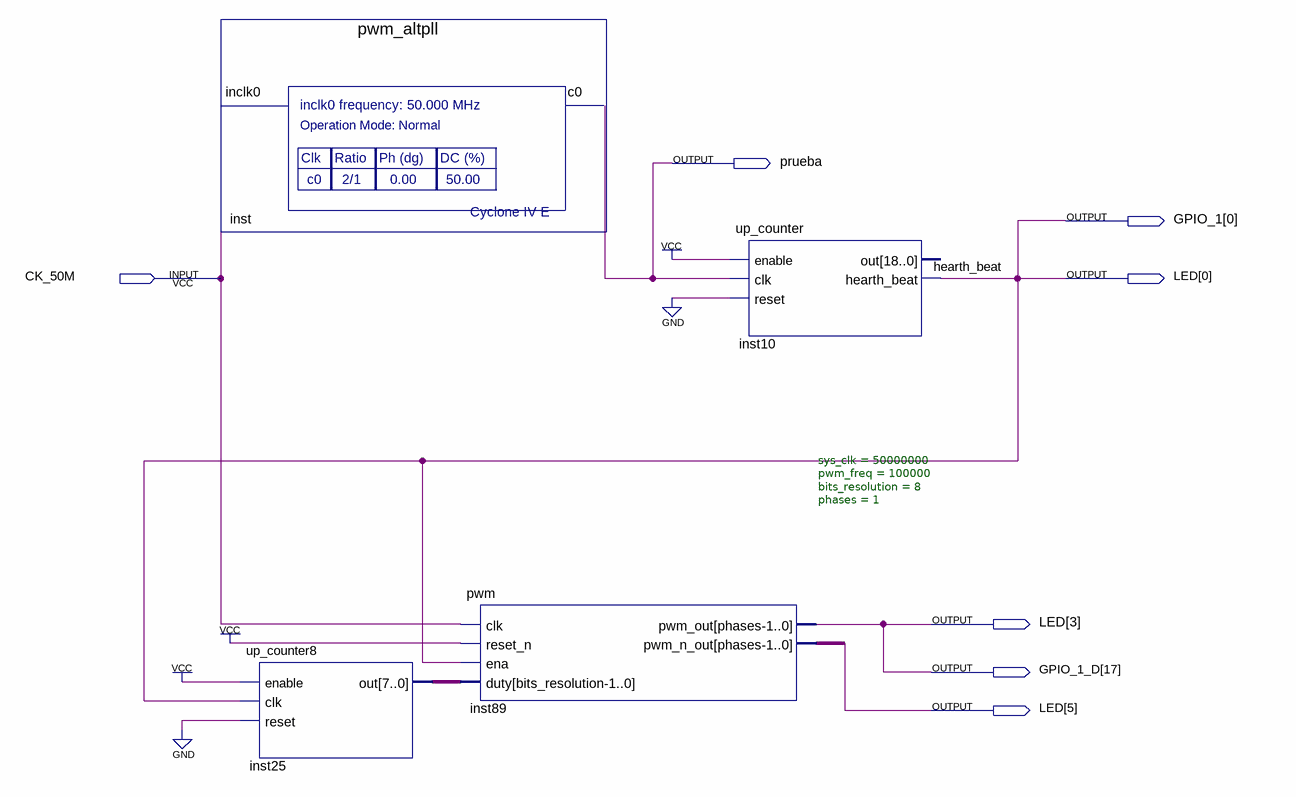
[diagram p0: schematic sheet]
// Quartus schematic Block2.bdf as structural Verilog: 4 symbols, 7 pins
module Block2 (
  input  CK_50M,
  output prueba,
  output [0:0] GPIO_1,
  output [5:0] LED,
  output [17:17] GPIO_1_D
);

  wire inst89_pwm_n_out;
  wire [7:0] inst25_out;

  pwm_altpll inst (.inclk0(CK_50M), .c0(prueba));
  up_counter8 inst25 (.enable(1'b1), .clk(GPIO_1[0]), .reset(1'b0), .out(inst25_out));
  pwm #(.sys_clk(50000000), .pwm_freq(100000), .bits_resolution(8), .phases(1)) inst89 (
    .clk(CK_50M), .reset_n(1'b1), .ena(GPIO_1[0]), .duty(inst25_out), .pwm_out(GPIO_1_D[17]),
    .pwm_n_out(inst89_pwm_n_out));
  up_counter inst10 (.enable(1'b1), .clk(prueba), .reset(1'b0), .hearth_beat(GPIO_1[0]));  // open: out

  assign {LED[3], LED[0]} = {GPIO_1_D[17], GPIO_1[0]};

  // Other names for the same wires on the sheet: hearth_beat = GPIO_1[0]
endmodule
